# Altium project PCB_Project1.PrjPCB
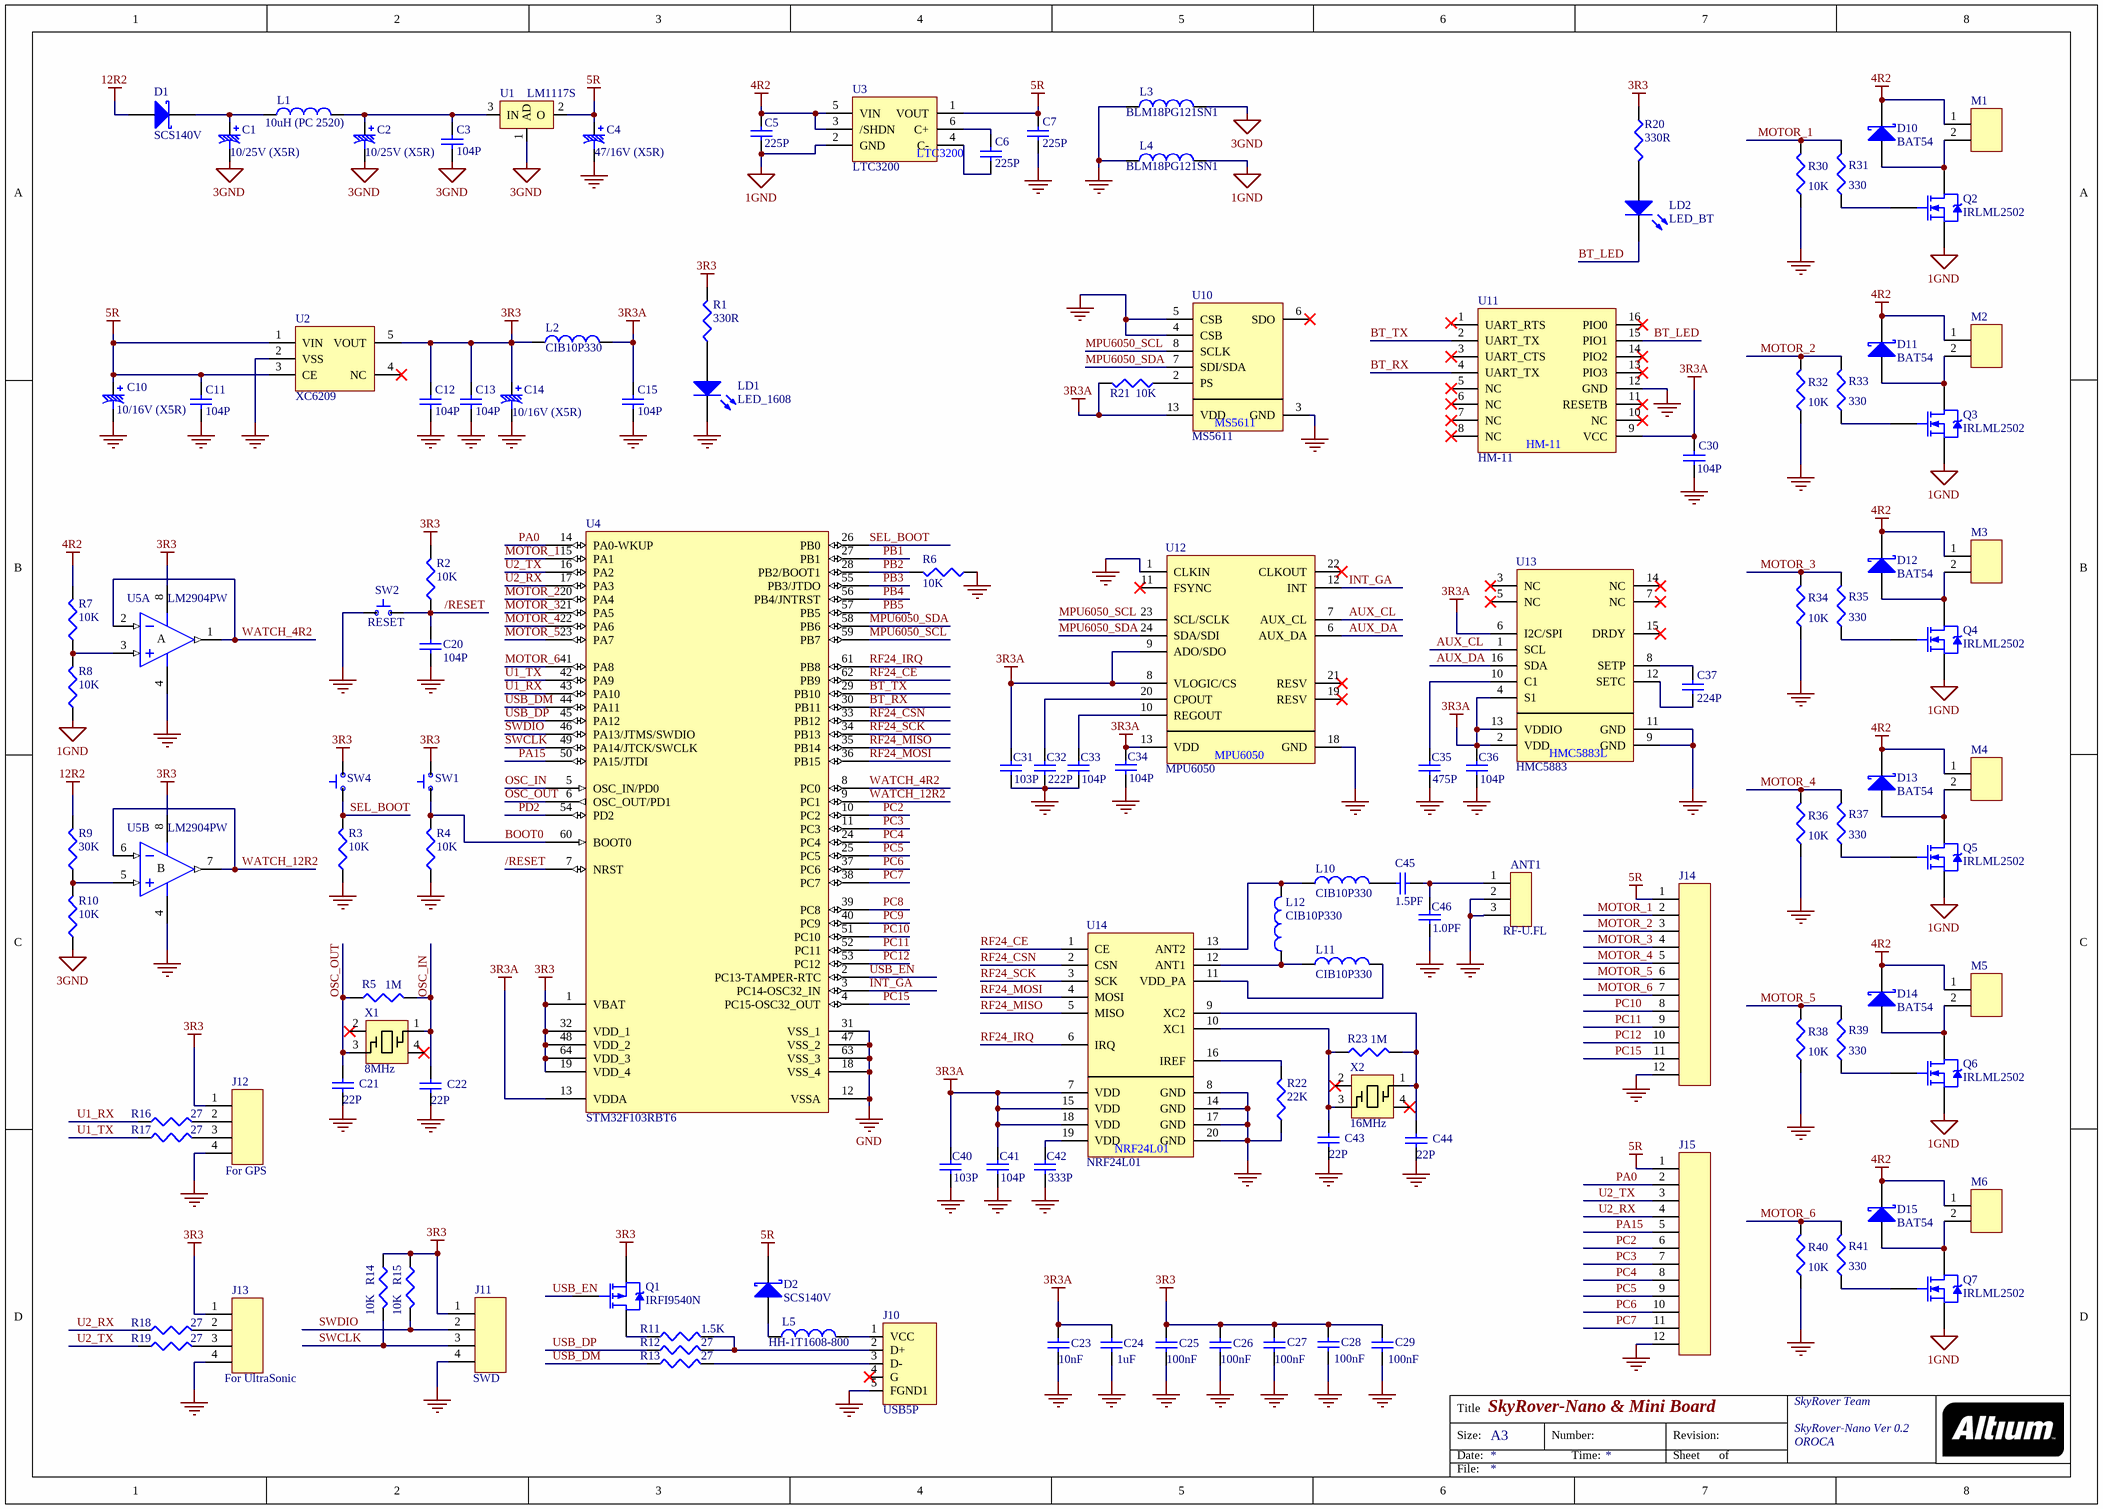
[diagram p0: SkyRover.SchDoc]
1 sheet, 126 parts. Net scope: global (net labels, ports and power ports of the same name join across sheets).

## Sheet SkyRover.SchDoc: SkyRover-Nano & Mini Board
size A3; Organization: SkyRover Team; Address2: SkyRover-Nano Ver 0.2; Address3: OROCA; PageSetup: Record=PageOptions|CenterHorizontal=True|CenterVertical=True|PrintScale=0.73|XCorrection=1.00|YCorrection=1.00|PrintKind=0|BorderSize=5000000|LeftOffset=0|BottomOffset=0|Orientation=2|PaperLength=1000|PaperWidth=1000|Scale=100|PaperSource=7|PrintQuality=-4|MediaType=1|DitherType=10|PaperKind=A4|PrintScaleMode=1

### Parts
ANT1  RF-U.FL  [U.FL-R-SMT]
C1  10/25V (X5R)  [C_3.2X1.6]
C2  10/25V (X5R)  [C_3.2X1.6]
C3  104P  [C_1608(0603)]
C4  47/16V (X5R)  [C_3.2X1.6]
C5  225P  [C_1608(0603)]
C6  225P  [C_1608(0603)]
C7  225P  [C_1608(0603)]
C10  10/16V (X5R)  [C_3.2X1.6]
C11  104P  [C_1608(0603)]
C12  104P  [C_1608(0603)]
C13  104P  [C_1608(0603)]
C14  10/16V (X5R)  [C_3.2X1.6]
C15  104P  [C_1608(0603)]
C20  104P  [C_2012(0805)]
C21  22P  [C_1608(0603)]
C22  22P  [C_1608(0603)]
C23  10nF  [C_1608(0603)]
C24  1uF  [C_2012(0805)]
C25  100nF  [C_1608(0603)]
C26  100nF  [C_1608(0603)]
C27  100nF  [C_1608(0603)]
C28  100nF  [C_1608(0603)]
C29  100nF  [C_1608(0603)]
C30  104P  [C_1608(0603)]
C31  103P  [C_1608(0603)]
C32  222P  [C_1608(0603)]
C33  104P  [C_1608(0603)]
C34  104P  [C_1608(0603)]
C35  475P  [C_1608(0603)]
C36  104P  [C_1608(0603)]
C37  224P  [C_1608(0603)]
C40  103P  [C_1608(0603)]
C41  104P  [C_1608(0603)]
C42  333P  [C_1608(0603)]
C43  22P  [C_1608(0603)]
C44  22P  [C_1608(0603)]
C45  1.5PF  [C_1608(0603)]
C46  1.0PF  [C_1608(0603)]
D1  SCS140V  [SMB]
D2  SCS140V  [SMB]
D10  BAT54  [SOT23_N]
D11  BAT54  [SOT23_N]
D12  BAT54  [SOT23_N]
D13  BAT54  [SOT23_N]
D14  BAT54  [SOT23_N]
D15  BAT54  [SOT23_N]
J10  USB5P  [USB-MIN5P]
J11  SWD  [MOLEX-53398-0471]
J12  For GPS  [MOLEX-53398-0471]
J13  For UltraSonic  [MOLEX-53398-0471]
J14  MOLEX-53398-1271  [MOLEX-53398-1271]  (value not drawn)
J15  MOLEX-53398-1271  [MOLEX-53398-1271]  (value not drawn)
L1  10uH (PC 2520)  [INDC1608L]
L2  CIB10P330  [INDC1608L]
L3  BLM18PG121SN1  [INDC1608L]
L4  BLM18PG121SN1  [INDC1608L]
L5  HH-1T1608-800  [INDC1608L]
L10  CIB10P330  [INDC1608L]
L11  CIB10P330  [INDC1608L]
L12  CIB10P330  [INDC1608L]
LD1  LED_1608  [LED_1608(0603)]
LD2  LED_BT  [LED_1608(0603)]
M1  MOLEX53261-0271  [MOLEX-53261-0271]  (value not drawn)
M2  MOLEX53261-0271  [MOLEX-53261-0271]  (value not drawn)
M3  MOLEX53261-0271  [MOLEX-53261-0271]  (value not drawn)
M4  MOLEX53261-0271  [MOLEX-53261-0271]  (value not drawn)
M5  MOLEX53261-0271  [MOLEX-53261-0271]  (value not drawn)
M6  MOLEX53261-0271  [MOLEX-53261-0271]  (value not drawn)
Q1  IRFI9540N  [TO-220_FullPak]
Q2  IRLML2502  [SOT-23_N]
Q3  IRLML2502  [SOT-23_N]
Q4  IRLML2502  [SOT-23_N]
Q5  IRLML2502  [SOT-23_N]
Q6  IRLML2502  [SOT-23_N]
Q7  IRLML2502  [SOT-23_N]
R1  330R  [R_1608(0603)]
R2  10K  [R_1608(0603)]
R3  10K  [R_1608(0603)]
R4  10K  [R_1608(0603)]
R5  value 1M  [J1-0603]
R6  10K  [R_1608(0603)]
R7  10K  [R_1608(0603)]
R8  10K  [R_1608(0603)]
R9  30K  [R_1608(0603)]
R10  10K  [R_1608(0603)]
R11  value 1.5K  [J1-0603]
R12  value 27  [J1-0603]
R13  value 27  [J1-0603]
R14  value 10K  [J1-0603]
R15  value 10K  [J1-0603]
R16  value 27  [J1-0603]
R17  value 27  [J1-0603]
R18  value 27  [J1-0603]
R19  value 27  [J1-0603]
R20  330R  [R_1608(0603)]
R21  10K  [R_1608(0603)]
R22  22K  [R_1608(0603)]
R23  value 1M  [J1-0603]
R30  10K  [R_1608(0603)]
R31  value 330  [J1-0603]
R32  10K  [R_1608(0603)]
R33  value 330  [J1-0603]
R34  10K  [R_1608(0603)]
R35  value 330  [J1-0603]
R36  10K  [R_1608(0603)]
R37  value 330  [J1-0603]
R38  10K  [R_1608(0603)]
R39  value 330  [J1-0603]
R40  10K  [R_1608(0603)]
R41  value 330  [J1-0603]
SW1  (no value)  [CTT-1101NEA-160]
SW2  RESET  [CTT-1101NEA-160]
SW4  (no value)  [CTT-1101NEA-160]
U1  LM1117S  [SOT223]
U2  XC6209  [XC6209]
U3  LTC3200  [LTC3200]
U4  STM32F103RBT6  [LQFP64_M]
U5  LM2904PW  [PW008_M]  (parts A,B of 2)
U10  MS5611  [MS5611]
U11  HM-11  [HM-11]
U12  MPU6050  [MPU6050]
U13  HMC5883  [HMC5883L]
U14  NRF24L01  [nRF24L01]
X1  8MHz  [OSC_5032]
X2  16MHz  [OSC_5032]

### Nets
1GND: C5.1 L4.2 Q2.2(S) Q3.2(S) Q4.2(S) Q5.2(S) Q6.2(S) Q7.2(S) R8.1 U3.2(GND)
3GND: C1.2 C2.2 C3.1 L3.2 R10.1 U1.1(AD)
3R3: C12.2 C13.2 C14.1 C25.2 C26.2 C27.2 C28.2 C29.2 J11.1 J12.1 J13.1 L2.1 Q1.3(S) R1.2 R2.2 R14.1 R15.1 R20.1 SW1.2 SW4.2 U2.5(VOUT) U4.1(VBAT) U4.19(VDD_4) U4.32(VDD_1) U4.48(VDD_2) U4.64(VDD_3) U5.8(V+)
3R3A: C15.2 C23.2 C24.2 C30.2 C31.2 C34.2 C40.2 C41.2 L2.2 R21.2 U4.13(VDDA) U10.13(VDD) U11.9(VCC) U12.8(VLOGIC/CS) U12.9(ADO/SDO) U12.13(VDD) U13.2(VDD) U13.4(S1) U13.6(I2C/SPI) U13.13(VDDIO) U14.7(VDD) U14.15(VDD) U14.18(VDD)
4R2: C5.2 D10.3(K) D11.3(K) D12.3(K) D13.3(K) D14.3(K) D15.3(K) M1.1 M2.1 M3.1 M4.1 M5.1 M6.1 R7.2 U3.3(/SHDN) U3.5(VIN)
5R: C4.1 C7.2 C10.1 C11.2 D2.2(K) J14.1 J15.1 U1.2(O) U2.1(VIN) U2.3(CE) U3.1(VOUT)
12R2: D1.1(A) R9.2
GND: ANT1.2(GND) ANT1.3(GND) C4.2 C7.1 C10.2 C11.1 C12.1 C13.1 C14.2 C15.1 C20.1 C21.1 C22.1 C23.1 C24.1 C25.1 C26.1 C27.1 C28.1 C29.1 C30.1 C31.1 C32.1 C33.1 C34.1 C35.1 C36.1 C40.1 C41.1 C42.1 C43.1 C44.1 C46.1 J10.5(FGND1) J11.4 J12.4 J13.4 J14.12 J15.12 L3.1 L4.1 LD1.2(K) R3.1 R4.1 R6.1 R22.1 R30.1 R32.1 R34.1 R36.1 R38.1 R40.1 SW2.1 U2.2(VSS) U4.12(VSSA) U4.18(VSS_4) U4.31(VSS_1) U4.47(VSS_2) U4.63(VSS_3) U5.4(V-) U10.3(GND) U10.4(CSB) U10.5(CSB) U11.12(GND) U12.1(CLKIN) U12.18(GND) U13.9(GND) U13.11(GND) U14.8(GND) U14.14(GND) U14.17(GND) U14.20(GND)
/RESET: C20.2 R2.1 SW2.2 U4.7(NRST)
AUX_CL: U12.7(AUX_CL) U13.1(SCL)
AUX_DA: U12.6(AUX_DA) U13.16(SDA)
BOOT0: R4.2 SW1.1 U4.60(BOOT0)
BT_LED: LD2.2(K) U11.15(PIO1)
BT_RX: U4.30(PB11) U11.4(UART_TX)
BT_TX: U4.29(PB10) U11.2(UART_TX)
INT_GA: U4.3(PC14-OSC32_IN) U12.12(INT)
MOTOR_1: J14.2 R30.2 R31.2 U4.15(PA1)
MOTOR_2: J14.3 R32.2 R33.2 U4.20(PA4)
MOTOR_3: J14.4 R34.2 R35.2 U4.21(PA5)
MOTOR_4: J14.5 R36.2 R37.2 U4.22(PA6)
MOTOR_5: J14.6 R38.2 R39.2 U4.23(PA7)
MOTOR_6: J14.7 R40.2 R41.2 U4.41(PA8)
MPU6050_SCL: U4.59(PB7) U10.8(SCLK) U12.23(SCL/SCLK)
MPU6050_SDA: U4.58(PB6) U10.7(SDI/SDA) U12.24(SDA/SDI)
OSC_IN: C22.2 R5.2 U4.5(OSC_IN/PD0) X1.1
OSC_OUT: C21.2 R5.1 U4.6(OSC_OUT/PD1) X1.3
PA0: J15.2 U4.14(PA0-WKUP)
PA15: J15.5 U4.50(PA15/JTDI)
PB1: U4.27(PB1)
PB2: R6.2 U4.28(PB2/BOOT1)
PB3: U4.55(PB3/JTDO)
PB4: U4.56(PB4/JNTRST)
PB5: U4.57(PB5)
PC2: J15.6 U4.10(PC2)
PC3: J15.7 U4.11(PC3)
PC4: J15.8 U4.24(PC4)
PC5: J15.9 U4.25(PC5)
PC6: J15.10 U4.37(PC6)
PC7: J15.11 U4.38(PC7)
PC8: U4.39(PC8)
PC9: U4.40(PC9)
PC10: J14.8 U4.51(PC10)
PC11: J14.9 U4.52(PC11)
PC12: J14.10 U4.53(PC12)
PC15: J14.11 U4.4(PC15-OSC32_OUT)
PD2: U4.54(PD2)
RF24_CE: U4.62(PB9) U14.1(CE)
RF24_CSN: U4.33(PB12) U14.2(CSN)
RF24_IRQ: U4.61(PB8) U14.6(IRQ)
RF24_MISO: U4.35(PB14) U14.5(MISO)
RF24_MOSI: U4.36(PB15) U14.4(MOSI)
RF24_SCK: U4.34(PB13) U14.3(SCK)
SEL_BOOT: R3.2 SW4.1 U4.26(PB0)
SWCLK: J11.3 R14.2 U4.49(PA14/JTCK/SWCLK)
SWDIO: J11.2 R15.2 U4.46(PA13/JTMS/SWDIO)
U1_RX: R16.1 U4.43(PA10)
U1_TX: R17.1 U4.42(PA9)
U2_RX: J15.4 R18.1 U4.17(PA3)
U2_TX: J15.3 R19.1 U4.16(PA2)
USB_DM: R13.1 U4.44(PA11)
USB_DP: R12.1 U4.45(PA12)
USB_EN: Q1.1(G) U4.2(PC13-TAMPER-RTC)
WATCH_4R2: U4.8(PC0) U5.1(OUT) U5.2(IN-)
WATCH_12R2: U4.9(PC1) U5.6(IN-) U5.7(OUT)
NetANT1_1: ANT1.1(SIG) C45.1 C46.2
NetC1_1: C1.1 D1.2(K) L1.1
NetC2_1: C2.1 C3.2 L1.2 U1.3(IN)
NetC6_1: C6.1 U3.4(C-)
NetC6_2: C6.2 U3.6(C+)
NetC32_2: C32.2 U12.20(CPOUT)
NetC33_2: C33.2 U12.10(REGOUT)
NetC35_2: C35.2 U13.10(C1)
NetC37_1: C37.1 U13.12(SETC)
NetC37_2: C37.2 U13.8(SETP)
NetC42_2: C42.2 U14.19(VDD)
NetC43_2: C43.2 R23.1 U14.10(XC1) X2.3
NetC44_2: C44.2 R23.2 U14.9(XC2) X2.1
NetC45_2: C45.2 L10.2
NetD2_1: D2.1(A) L5.1
NetD10_1: D10.1(A) M1.2 Q2.3(D)
NetD11_1: D11.1(A) M2.2 Q3.3(D)
NetD12_1: D12.1(A) M3.2 Q4.3(D)
NetD13_1: D13.1(A) M4.2 Q5.3(D)
NetD14_1: D14.1(A) M5.2 Q6.3(D)
NetD15_1: D15.1(A) M6.2 Q7.3(D)
NetJ10_1: J10.1(VCC) L5.2
NetJ10_2: J10.2(D+) R11.2 R12.2
NetJ10_3: J10.3(D-) R13.2
NetJ12_2: J12.2 R16.2
NetJ12_3: J12.3 R17.2
NetJ13_2: J13.2 R18.2
NetJ13_3: J13.3 R19.2
NetL10_1: L10.1 L12.2 U14.13(ANT2)
NetL11_1: L11.1 L12.1 U14.12(ANT1)
NetL11_2: L11.2 U14.11(VDD_PA)
NetLD1_1: LD1.1(A) R1.1
NetLD2_1: LD2.1(A) R20.2
NetQ1_2: Q1.2(D) R11.1
NetQ2_1: Q2.1(G) R31.1
NetQ3_1: Q3.1(G) R33.1
NetQ4_1: Q4.1(G) R35.1
NetQ5_1: Q5.1(G) R37.1
NetQ6_1: Q6.1(G) R39.1
NetQ7_1: Q7.1(G) R41.1
NetR7_1: R7.1 R8.2 U5.3(IN+)
NetR9_1: R9.1 R10.2 U5.5(IN+)
NetR21_1: R21.1 U10.2(PS)
NetR22_2: R22.2 U14.16(IREF)

Not connected (* = marked no-connect by the designer): C36 2; J10 4(G)*; U2 4(NC)*; U10 6(SDO)*; U11 1(UART_RTS) 3(UART_CTS)* 5(NC)* 6(NC) 7(NC)* 8(NC)* 10(NC)* 11(RESETB)* 13(PIO3)* 14(PIO2)* 16(PIO0)*; U12 11(FSYNC)* 19(RESV)* 21(RESV)* 22(CLKOUT)*; U13 3(NC)* 5(NC)* 7(NC)* 14(NC)* 15(DRDY)*; X1 2* 4*; X2 2* 4*

### Notes on the sheet
- Title
- Size:
- Date:
- A3
- Number:
- Time:
- Revision:
- Sheet
- of
- File:
- (in symbol HMC5883) HMC5883L
- (in symbol LM2904PW, part A) A
- (in symbol LM2904PW, part B) B

### Library data of the parts
C1 C2 C4 C10 C14 = CAP_ELEC: Electrolytic Capacitor; Manufacture: SAMYOUNG(KMG); Mounting type: DIP; Size: íD:L=10:12.5, Pitch=5mm
  C1 C2: Value: 10/25V (X5R)
  C4: Value: 47/16V (X5R)
  C10 C14: Value: 10/16V (X5R)
C3 C5-C7 C11-C13 C15 C20-C37 C40-C46 = CAP: Ceramic Capacitor; Manufacture: *; Mounting type: SMD
  C3 C11-C13 C15 C30 C33 C34 C36 C41: Value: 104P; Size: 1608
  C5-C7: Value: 225P; Size: 1608
  C20: Value: 104P; Size: 2012
  C21 C22 C43 C44: Value: 22P; Size: 1608
  C23: Value: 10nF; Size: 1608
  C24: Value: 1uF; Size: 2012
  C25-C29: Value: 100nF; Size: 1608
  C31 C40: Value: 103P; Size: 1608
  C32: Value: 222P; Size: 1608
  C35: Value: 475P; Size: 1608
  C37: Value: 224P; Size: 1608
  C42: Value: 333P; Size: 1608
  C45: Value: 1.5PF; Size: 1608
  C46: Value: 1.0PF; Size: 1608
D1 D2 = D Schottky: Schottky Diode; Published: 8-Jun-2000; LatestRevisionDate: 17-Jul-2002; LatestRevisionNote: Re-released for DXP Platform.; PackageReference: SMB; Publisher: Altium Limited; PackageDescription: DO-214-AA/SMB; 2 C-Bend Leads; Body 5.3 x 3.6 mm, inc. leads (LxW); Code_JEDEC: DO-214-AA
D10-D15 = BAT54: Schottky Barrier Diode; Note: Pin 2 is not connected and is not drawn; Published: 17-Sep-2003; LatestRevisionDate: 12-Dec-2006; LatestRevisionNote: IPC-7351 Footprint Added.; DatasheetVersion: 4-Mar-2002; PackageVersion: May-1999; PackageReference: SOT23; Publisher: Altium Limited; PackageDescription: 3-Pin SOT-23 Package 0.95 mm Pitch, 2.3 mm Lead Span; ComponentLink1Description: Manufacturer Link; ComponentLink1URL: http://www.semiconductors.philips.com/; ComponentLink2Description: Datasheet; ComponentLink2URL: http://www.semiconductors.philips.com/acrobat/datasheets/BAT54_SERIES_4.pdf
J10 = USB5P: Connector USB
J11-J13 = MOLEX-53398-471
L1-L5 = Inductor: Code_IEC: 1005; Value: 100uH; Published: 8-Jun-2000; LatestRevisionDate: 29-May-2009; LatestRevisionNote: IPC-7351 Footprint Added.; PackageReference: 0402-A; Publisher: Altium Limited; PackageDescription: Chip Inductor; Code_JEITA: 0402
L10 = Inductor: Code_IEC: 1005; Value: 3.9nH; Published: 8-Jun-2000; LatestRevisionDate: 29-May-2009; LatestRevisionNote: IPC-7351 Footprint Added.; PackageReference: 0402-A; Publisher: Altium Limited; PackageDescription: Chip Inductor; Code_JEITA: 0402
L11 = Inductor: Code_IEC: 1005; Value: 2.7nH; Published: 8-Jun-2000; LatestRevisionDate: 29-May-2009; LatestRevisionNote: IPC-7351 Footprint Added.; PackageReference: 0402-A; Publisher: Altium Limited; PackageDescription: Chip Inductor; Code_JEITA: 0402
L12 = Inductor: Code_IEC: 1005; Value: 8.2nH; Published: 8-Jun-2000; LatestRevisionDate: 29-May-2009; LatestRevisionNote: IPC-7351 Footprint Added.; PackageReference: 0402-A; Publisher: Altium Limited; PackageDescription: Chip Inductor; Code_JEITA: 0402
LD1 LD2 = LED: IBLUE; Manufacture: *; Size: ヵ5; Mounting type: DIP
Q1 = IRFI9540N: HEXFET Power MOSFET; Published: 8-Jun-2000; LatestRevisionDate: 17-Jul-2002; LatestRevisionNote: Re-released for DXP Platform.; DatasheetVersion: Mar-1998; PackageVersion: Mar-1998; PackageReference: TO-220_Fullpak; Publisher: Altium Limited; PackageDescription: TO, Thru-Hole, Vertical, Heatsink Mounted; 3 In-Line Leads; Pitch 2.54 mm; ComponentLink1Description: Manufacturer Link; ComponentLink1URL: http://www.irf.com/; ComponentLink2Description: Datasheet; ComponentLink2URL: http://www.irf.com/product-info/datasheets/data/irfi9540n.pdf
Q2-Q7 = IRLML2402: HEXFET Power MOSFET; Published: 8-Jun-2000; LatestRevisionDate: 20-Nov-2009; LatestRevisionNote: IPC-7351 Footprint Added.; DatasheetVersion: Aug-1997; PackageReference: SOT-23; Publisher: Altium Limited; PackageDescription: 3-Pin SOT-23 Package 0.95 mm Pitch, 2.3 mm Lead Span; ComponentLink1Description: Manufacturer Link; ComponentLink1URL: http://www.irf.com/; ComponentLink2Description: Datasheet; ComponentLink2URL: http://www.irf.com/product-info/datasheets/data/irlml2402.pdf
R1-R4 R6-R10 R20-R22 R30 R32 R34 R36 R38 R40 = RES1: Chip Resistor; Manufacture: *; Mounting type: SMD; Size: 2012
  R1 R20: Value: 330R
  R2-R4 R6-R8 R10 R21 R30 R32 R34 R36 R38 R40: Value: 10K
  R9: Value: 30K
  R22: Value: 22K
R5 R11-R19 R23 R31 R33 R35 R37 R39 R41 = Res3: Resistor; Published: 8-Jun-2000; LatestRevisionDate: 29-May-2009; LatestRevisionNote: IPC-7351 Footprint Added.; PackageReference: J1-0603; Publisher: Altium Limited; PackageDescription: Chip Resistor
SW1 SW2 SW4 = SWITCH: SMD push switch; Manufacture: *; Mounting type: SMD
U1 = LM1117S: IC
U4 = STM32F103RBT6: STM32 ARM-based 32-bit MCU with 128 Kbytes Flash, 64-pin LQFP, Industrial Temperature; Published: 30-May-2008; DatasheetVersion: rev6, Mar-2008; PackageVersion: Mar-2008; PackageReference: LQFP64; Publisher: Altium Limited; PackageDescription: 64-Pin Low-Profile Quad Flat Pack, 10 x 10 mm Body, 0.5 mm Pitch (LQFP64); ComponentLink1Description: Manufacturer Link; ComponentLink1URL: www.st.com/stm32; ComponentLink2Description: Datasheet; ComponentLink2URL: http://www.st.com/stonline/products/literature/ds/13587.pdf
U5 = LM2904PW: Dual Operational Amplifier; Published: 16-Jan-2001; LatestRevisionDate: 16-Oct-2006; LatestRevisionNote: IPC-7351 Footprint Added.; DatasheetVersion: Jul-1998; PackageVersion: Feb-1999; PackageReference: PW008; Publisher: Altium Limited; PackageDescription: 8-Pin Small Outline Package 0.65 mm Pitch; Code_JEDEC: MO-153; ComponentLink1Description: Manufacturer Link; ComponentLink1URL: http://www.ti.com/; ComponentLink2Description: Datasheet; ComponentLink2URL: http://www-s.ti.com/sc/ds/lm2904.pdf
X1 X2 = OSC_5032